# Altium project GeneralSensorBoardProject.PrjPcb
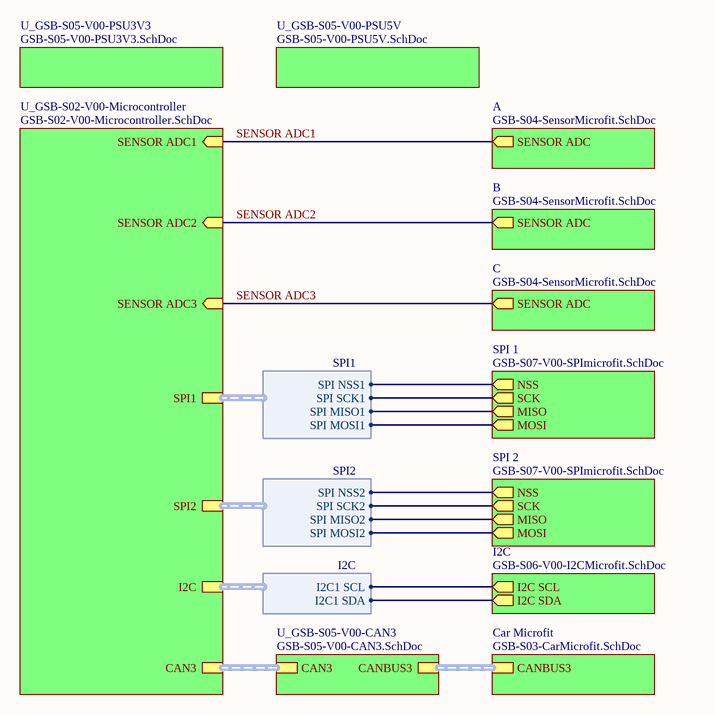
[diagram p0: GSB-S01-V00-GeneralSensorBoard.SchDoc]
4 sheets, 26 parts. Net scope: hierarchical (ports join the sheet entries above them; power ports are global).
Board file: GSB-P01-V00.PcbDoc
Sheets:
  GSB-S01-V00-GeneralSensorBoard.SchDoc
    U_GSB-S02-V00-Microcontroller = GSB-S02-V00-Microcontroller.SchDoc
    Car Microfit = GSB-S03-CarMicrofit.SchDoc
    SPI 1 = GSB-S07-V00-SPImicrofit.SchDoc
    SPI 2 = GSB-S07-V00-SPImicrofit.SchDoc

## Sheet GSB-S01-V00-GeneralSensorBoard.SchDoc
size A3

### Sub-sheets
A = GSB-S04-SensorMicrofit.SchDoc (file not in this document): SENSOR ADC (out)
B = GSB-S04-SensorMicrofit.SchDoc (file not in this document): SENSOR ADC (out)
C = GSB-S04-SensorMicrofit.SchDoc (file not in this document): SENSOR ADC (out)
Car Microfit = GSB-S03-CarMicrofit.SchDoc: CANBUS3 (harness CANBUS3)
I2C = GSB-S06-V00-I2CMicrofit.SchDoc (file not in this document): I2C SCL (out), I2C SDA (out)
SPI 1 = GSB-S07-V00-SPImicrofit.SchDoc: NSS (out), SCK (out), MISO (out), MOSI (out)
SPI 2 = GSB-S07-V00-SPImicrofit.SchDoc: NSS (out), SCK (out), MISO (out), MOSI (out)
U_GSB-S02-V00-Microcontroller = GSB-S02-V00-Microcontroller.SchDoc: I2C (harness I2C), CAN3 (harness CAN3), SPI1 (harness SPI1), SPI2 (harness SPI2), SENSOR ADC2 (in), SENSOR ADC1 (in), SENSOR ADC3 (in)
U_GSB-S05-V00-CAN3 = GSB-S05-V00-CAN3.SchDoc (file not in this document): CANBUS3 (harness CANBUS3), CAN3 (harness CAN3)
U_GSB-S05-V00-PSU3V3 = GSB-S05-V00-PSU3V3.SchDoc (file not in this document): no entries
U_GSB-S05-V00-PSU5V = GSB-S05-V00-PSU5V.SchDoc (file not in this document): no entries

### Harnesses
SPI1: SPI SCK1, SPI MISO1, SPI NSS1, SPI MOSI1
SPI2: SPI SCK2, SPI MISO2, SPI NSS2, SPI MOSI2
I2C: I2C1 SCL, I2C1 SDA

### Nets
I2C1 SCL: sheet I2C/I2C SCL, sheet U_GSB-S02-V00-Microcontroller/I2C.I2C1 SCL
I2C1 SDA: sheet I2C/I2C SDA, sheet U_GSB-S02-V00-Microcontroller/I2C.I2C1 SDA
SENSOR ADC1: sheet U_GSB-S02-V00-Microcontroller/SENSOR ADC1, sheet A/SENSOR ADC
SENSOR ADC2: sheet U_GSB-S02-V00-Microcontroller/SENSOR ADC2, sheet B/SENSOR ADC
SENSOR ADC3: sheet U_GSB-S02-V00-Microcontroller/SENSOR ADC3, sheet C/SENSOR ADC
SPI MISO1: sheet SPI 1/MISO, sheet U_GSB-S02-V00-Microcontroller/SPI1.SPI MISO1
SPI MISO2: sheet SPI 2/MISO, sheet U_GSB-S02-V00-Microcontroller/SPI2.SPI MISO2
SPI MOSI1: sheet SPI 1/MOSI, sheet U_GSB-S02-V00-Microcontroller/SPI1.SPI MOSI1
SPI MOSI2: sheet SPI 2/MOSI, sheet U_GSB-S02-V00-Microcontroller/SPI2.SPI MOSI2
SPI NSS1: sheet SPI 1/NSS, sheet U_GSB-S02-V00-Microcontroller/SPI1.SPI NSS1
SPI NSS2: sheet SPI 2/NSS, sheet U_GSB-S02-V00-Microcontroller/SPI2.SPI NSS2
SPI SCK1: sheet SPI 1/SCK, sheet U_GSB-S02-V00-Microcontroller/SPI1.SPI SCK1
SPI SCK2: sheet SPI 2/SCK, sheet U_GSB-S02-V00-Microcontroller/SPI2.SPI SCK2

### Buses and harness runs
harness sheet Car Microfit/CANBUS3 = sheet U_GSB-S05-V00-CAN3/CANBUS3
harness sheet U_GSB-S02-V00-Microcontroller/CAN3 = sheet U_GSB-S05-V00-CAN3/CAN3

## Sheet GSB-S02-V00-Microcontroller.SchDoc: General Sensor Board
size A3; DrawnBy: Zoe Goodward; Revision: 01; SheetNumber: 1; SheetTotal: 1; Version: 01; Project: Battery Managment System 2020; PageSetup: Record=PageOptions|CenterHorizontal=True|CenterVertical=True|PrintScale=0.97|XCorrection=1.00|YCorrection=1.00|PrintKind=0|BorderSize=5000000|LeftOffset=0|BottomOffset=0|Orientation=2|PaperLength=1000|PaperWidth=1000|Scale=100|PaperSource=7|PrintQuality=-4|MediaType=1|DitherType=10|PaperKind=A4|PrintScaleMode=1
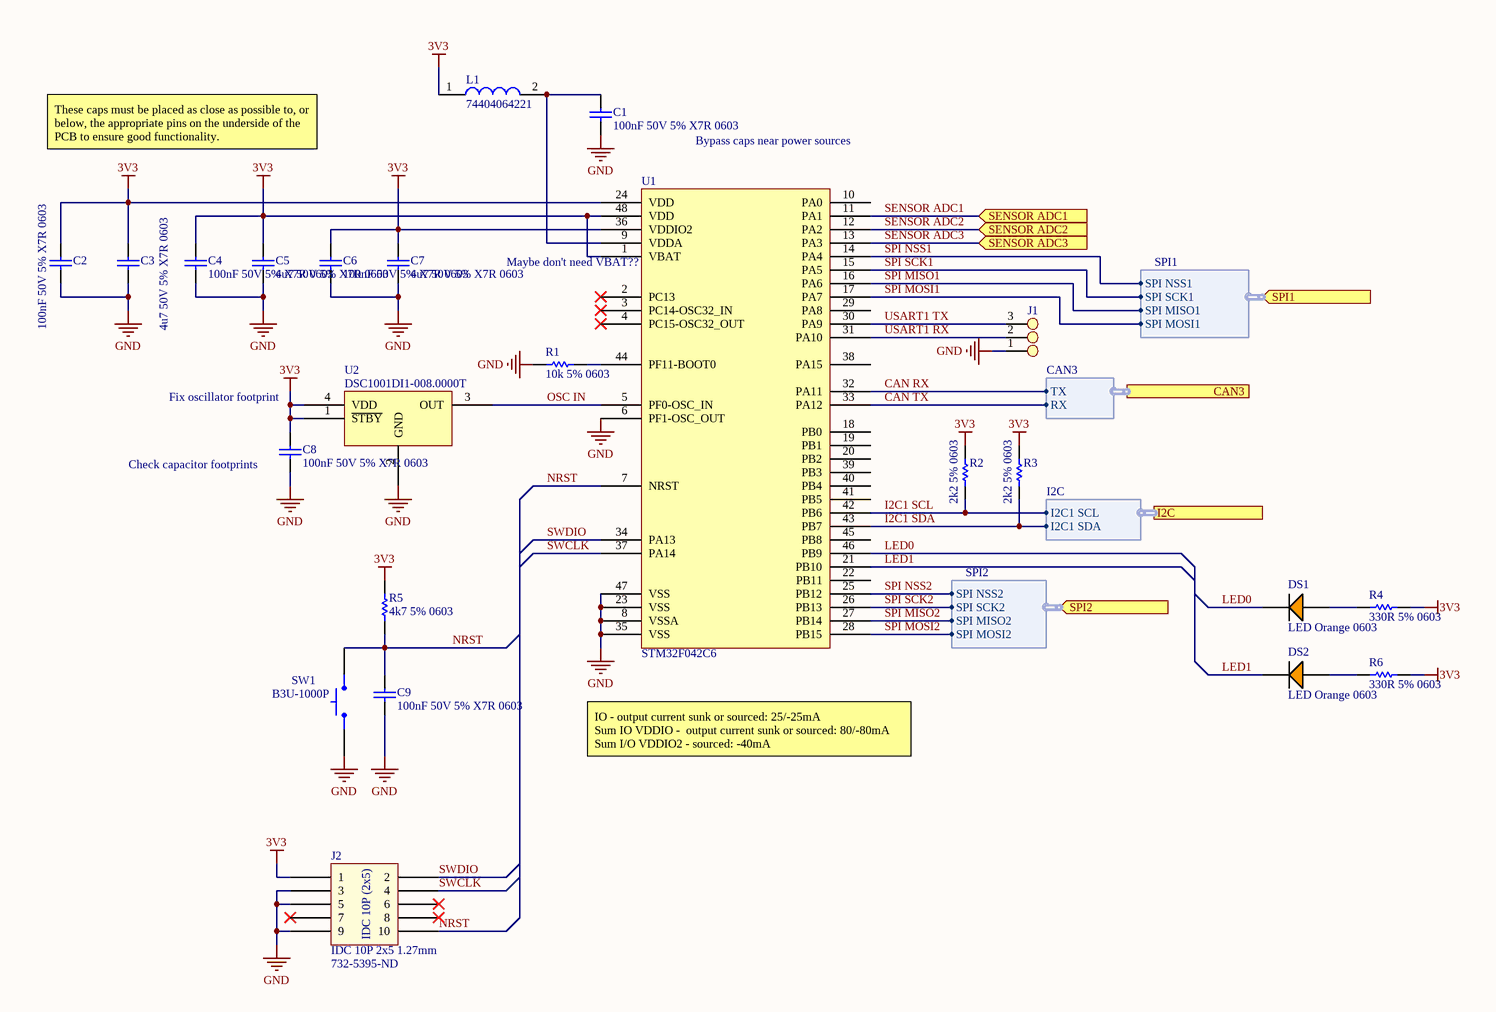
[diagram p1: GSB-S02-V00-Microcontroller.SchDoc]

### Parts
C1  100nF 50V 5% X7R 0603  [Cap_Ceramic_0603]
C2  100nF 50V 5% X7R 0603  [Cap_Ceramic_0603]
C3  4u7 50V 5% X7R 0603  [Cap_Ceramic_0603]
C4  100nF 50V 5% X7R 0603  [Cap_Ceramic_0603]
C5  4u7 50V 5% X7R 0603  [Cap_Ceramic_0603]
C6  100nF 50V 5% X7R 0603  [Cap_Ceramic_0603]
C7  4u7 50V 5% X7R 0603  [Cap_Ceramic_0603]
C8  100nF 50V 5% X7R 0603  [Cap_Ceramic_0603]
C9  100nF 50V 5% X7R 0603  [Cap_Ceramic_0603]
DS1  LED Orange 0603  [LED ORANGE 0603]
DS2  LED Orange 0603  [LED ORANGE 0603]
J1  Jumper 3Way Pins  [Jumper_3Way_Pin]  (value not drawn)
J2  IDC 10P 2x5 1.27mm  [IDC 1.27MM 10P]
L1  74404064221  [Inductor_6x6mm]
R1  10k 5% 0603  [Res_ThinFilm_0603]
R2  2k2 5% 0603  [Res_ThinFilm_0603]
R3  2k2 5% 0603  [Res_ThinFilm_0603]
R4  330R 5% 0603  [Res_ThinFilm_0603]
R5  4k7 5% 0603  [Res_ThinFilm_0603]
R6  330R 5% 0603  [Res_ThinFilm_0603]
SW1  B3U-1000P  [BTN B3U-1000P]
U1  STM32F042C6  [STM32F042C6]
U2  DSC1001DI1-008.0000T  [DSC1001DI1-008.0000TCT-ND]

### Ports
CAN3 (harness CAN3), I2C (harness I2C), SENSOR ADC1 (in), SENSOR ADC2 (in), SENSOR ADC3 (in), SPI1 (in, harness SPI1), SPI2 (in, harness SPI2)

### Harnesses
I2C: I2C1 SCL, I2C1 SDA
CAN3: RX, TX
SPI1: SPI SCK1, SPI MISO1, SPI NSS1, SPI MOSI1
SPI2: SPI SCK2, SPI MISO2, SPI NSS2, SPI MOSI2

### Nets
3V3: C2.2 C3.2 C4.2 C5.2 C6.2 C7.2 C8.2 J2.1 L1.1 R2.2 R3.2 R4.2 R5.2 R6.2 U1.1(VBAT) U1.24(VDD) U1.36(VDDIO2) U1.48(VDD) U2.1(~{STBY}) U2.4(VDD)
GND: C1.1 C2.1 C3.1 C4.1 C5.1 C6.1 C7.1 C8.1 C9.1 J1.1 J2.3 J2.5 J2.9 R1.1 SW1.1 U1.6(PF1-OSC_OUT) U1.8(VSSA) U1.23(VSS) U1.35(VSS) U1.47(VSS) U2.2(GND)
CAN RX: U1.32(PA11) ; port CAN3.TX
CAN TX: U1.33(PA12) ; port CAN3.RX
I2C1 SCL: R2.1 U1.42(PB6) ; port I2C.I2C1 SCL
I2C1 SDA: R3.1 U1.43(PB7) ; port I2C.I2C1 SDA
LED0: DS1.2(C) U1.46(PB9)
LED1: DS2.2(C) U1.21(PB10)
NRST: C9.2 J2.10 R5.1 SW1.2 U1.7(NRST)
OSC IN: U1.5(PF0-OSC_IN) U2.3(OUT)
SENSOR ADC1: U1.11(PA1) ; port SENSOR ADC1
SENSOR ADC2: U1.12(PA2) ; port SENSOR ADC2
SENSOR ADC3: U1.13(PA3) ; port SENSOR ADC3
SPI MISO1: U1.16(PA6) ; port SPI1.SPI MISO1
SPI MISO2: U1.27(PB14) ; port SPI2.SPI MISO2
SPI MOSI1: U1.17(PA7) ; port SPI1.SPI MOSI1
SPI MOSI2: U1.28(PB15) ; port SPI2.SPI MOSI2
SPI NSS1: U1.14(PA4) ; port SPI1.SPI NSS1
SPI NSS2: U1.25(PB12) ; port SPI2.SPI NSS2
SPI SCK1: U1.15(PA5) ; port SPI1.SPI SCK1
SPI SCK2: U1.26(PB13) ; port SPI2.SPI SCK2
SWCLK: J2.4 U1.37(PA14)
SWDIO: J2.2 U1.34(PA13)
USART1 RX: J1.2 U1.31(PA10)
USART1 TX: J1.3 U1.30(PA9)
NetC1_2: C1.2 L1.2 U1.9(VDDA)
NetDS1_1: DS1.1(A) R4.1
NetDS2_1: DS2.1(A) R6.1
NetR1_2: R1.2 U1.44(PF11-BOOT0)

Not connected (* = marked no-connect by the designer): J2 6* 7* 8*; U1 2(PC13)* 3(PC14-OSC32_IN)* 4(PC15-OSC32_OUT)* 10(PA0) 18(PB0) 19(PB1) 20(PB2) 22(PB11) 29(PA8) 38(PA15) 39(PB3) 40(PB4) 41(PB5) 45(PB8)

### Notes on the sheet
- These caps must be placed as close as possible to, or below, the appropriate pins on the underside of the PCB to ensure good functionality.
- Bypass caps near power sources
- (near U1) Maybe don't need VBAT??
- Fix oscillator footprint
- (near C8) Check capacitor footprints
- IO - output current sunk or sourced: 25/-25mA
  Sum IO VDDIO -  output current sunk or sourced: 80/-80mA
  Sum I/O VDDIO2 - sourced: -40mA
- (near J2) 732-5395-ND
- Revision History:
- Sheet Title:
- Rev
- Date
- Description
- Project:
- Size:
- Drawn By:
- A3
- Number:
- Revision:
- Sheet
- Version:
- of
- QUT Motorsport
- O-120, Gardens Point
- 2 George Street
- Brisbane, QLD 4000
- Australia
- Print Date:
- Print Time:
- File Name:
- (in symbol IDC 10P 2x5 1.27mm) IDC 10P (2x5)

### Library data of the parts
C1 C2 C4 C6 C8 C9 = 100nF 50V 5% X7R 0603: Capacitor, Ceramic, SMD, 100nF, 50V, 5%, X7R, 0603
C3 C5 C7 = 4u7 50V 5% X7R 0603: Capacitor, Ceramic, SMD, 4u7, 50V, 5%, X7R, 0603
J1 = Jumper 3Way Side Pins
L1 = 74404064221: FIXED IND 220UH 660MA 850 MOHM; ComponentLink1Description: Digikey; ComponentLink1URL: https://www.digikey.com.au/product-detail/en/w%C3%BCrth-elektronik/74404064221/732-7261-1-ND/5353241; ComponentLink2Description: LCSC A; ComponentLink2URL: https://lcsc.com/product-detail/Power-Inductors_Sunlord-SWPA6045S221MT_C91047.html; ComponentLink3Description: LCSC B; ComponentLink3URL: https://lcsc.com/product-detail/Power-Inductors_SXN-Shun-Xiang-Nuo-Elec-SMNR6045-221MT_C467145.html
R1 = 10k 5% 0603: Resistor, SMD, 10k, 0.1W, 5%, 0603
R2 R3 = 2k2 5% 0603: Resistor, SMD, 2k2, 0.1W, 5%, 0603
R4 R6 = 330R 5% 0603: Resistor, SMD, 330R, 0.1W, 5%, 0603
R5 = 4k7 5% 0603: Resistor, SMD, 4k7, 0.1W, 5%, 0603
SW1 = BTN B3U-1000P: Omron B3U-1000P Ultra Miniture Switch; ComponentLink1Description: LCSC; ComponentLink1URL: https://lcsc.com/product-detail/Tactile-Switches_BRIGHT-TSA063G50-250_C294565.html
U1 = STM32F042C6: ARM® Cortex®-M0 STM32F0 Microcontroller IC 32-Bit 48MHz 32KB (32K x 8) FLASH 48-LQFP (7x7); ComponentLink1Description: Digikey; ComponentLink1URL: https://www.digikey.com.au/product-detail/en/stmicroelectronics/STM32F042C6T6TR/497-19319-1-ND/10063344; ComponentLink2Description: Datasheet; ComponentLink2URL: https://www.st.com/resource/en/datasheet/stm32f042k6.pdf
U2 = DSC1001DI1-008.0000T: 8MHz XO (Standard) CMOS Oscillator 1.8 ~ 3.3V Standby (Power Down) 4-SMD, No Lead

## Sheet GSB-S03-CarMicrofit.SchDoc
size A4
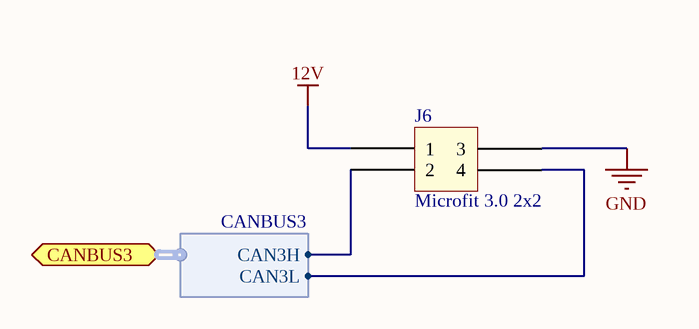
[diagram p2: GSB-S03-CarMicrofit.SchDoc]

### Parts
J6  Microfit 3.0 2x2  [Microfit_2X2_R_TH]

### Ports
CANBUS3 (bidir, harness CANBUS3)

### Harnesses
CANBUS3: CAN3H, CAN3L

### Nets
12V: J6.1
GND: J6.3
NetJ6_2: J6.2 ; port CANBUS3.CAN3H
NetJ6_4: J6.4 ; port CANBUS3.CAN3L

### Library data of the parts
J6 = Microfit_2x2

## Sheet GSB-S07-V00-SPImicrofit.SchDoc
size A4
Used 2 times, as channels SPI 1, SPI 2. Parts and nets are listed once, with the designators drawn on the sheet.
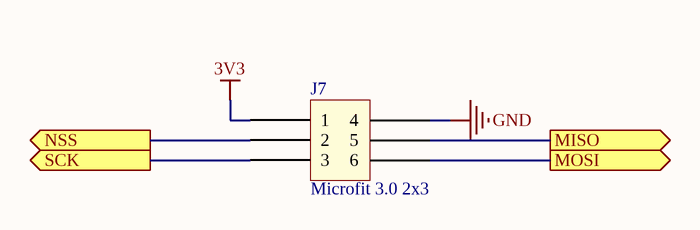
[diagram p3: GSB-S07-V00-SPImicrofit.SchDoc]

### Parts
J7  Microfit 3.0 2x3  [Microfit_2X3_R_TH]

### Ports
MISO (out), MOSI (out), NSS (out), SCK (out)

### Nets
3V3: J7.1
GND: J7.4
MISO: J7.5 ; port MISO
MOSI: J7.6 ; port MOSI
NSS: J7.2 ; port NSS
SCK: J7.3 ; port SCK

### Channels
SPI 1: designators end in _1; ports MISO=SPI MISO1 MOSI=SPI MOSI1 NSS=SPI NSS1 SCK=SPI SCK1
SPI 2: designators end in _2; ports MISO=SPI MISO2 MOSI=SPI MOSI2 NSS=SPI NSS2 SCK=SPI SCK2

### Library data of the parts
J7 = Microfit_2x3

## Nets that join several sheets
3V3: GSB-S02-V00-Microcontroller (20 pins), SPI 1 (J7_1.1), SPI 2 (J7_2.1)
GND: GSB-S02-V00-Microcontroller (21 pins), GSB-S03-CarMicrofit (J6.3), SPI 1 (J7_1.4), SPI 2 (J7_2.4)
SPI MISO1: GSB-S02-V00-Microcontroller (U1.16), SPI 1 (J7_1.5)
SPI MISO2: GSB-S02-V00-Microcontroller (U1.27), SPI 2 (J7_2.5)
SPI MOSI1: GSB-S02-V00-Microcontroller (U1.17), SPI 1 (J7_1.6)
SPI MOSI2: GSB-S02-V00-Microcontroller (U1.28), SPI 2 (J7_2.6)
SPI NSS1: GSB-S02-V00-Microcontroller (U1.14), SPI 1 (J7_1.2)
SPI NSS2: GSB-S02-V00-Microcontroller (U1.25), SPI 2 (J7_2.2)
SPI SCK1: GSB-S02-V00-Microcontroller (U1.15), SPI 1 (J7_1.3)
SPI SCK2: GSB-S02-V00-Microcontroller (U1.26), SPI 2 (J7_2.3)